# EAGLE design led-cube (EAGLE 6.5.0)
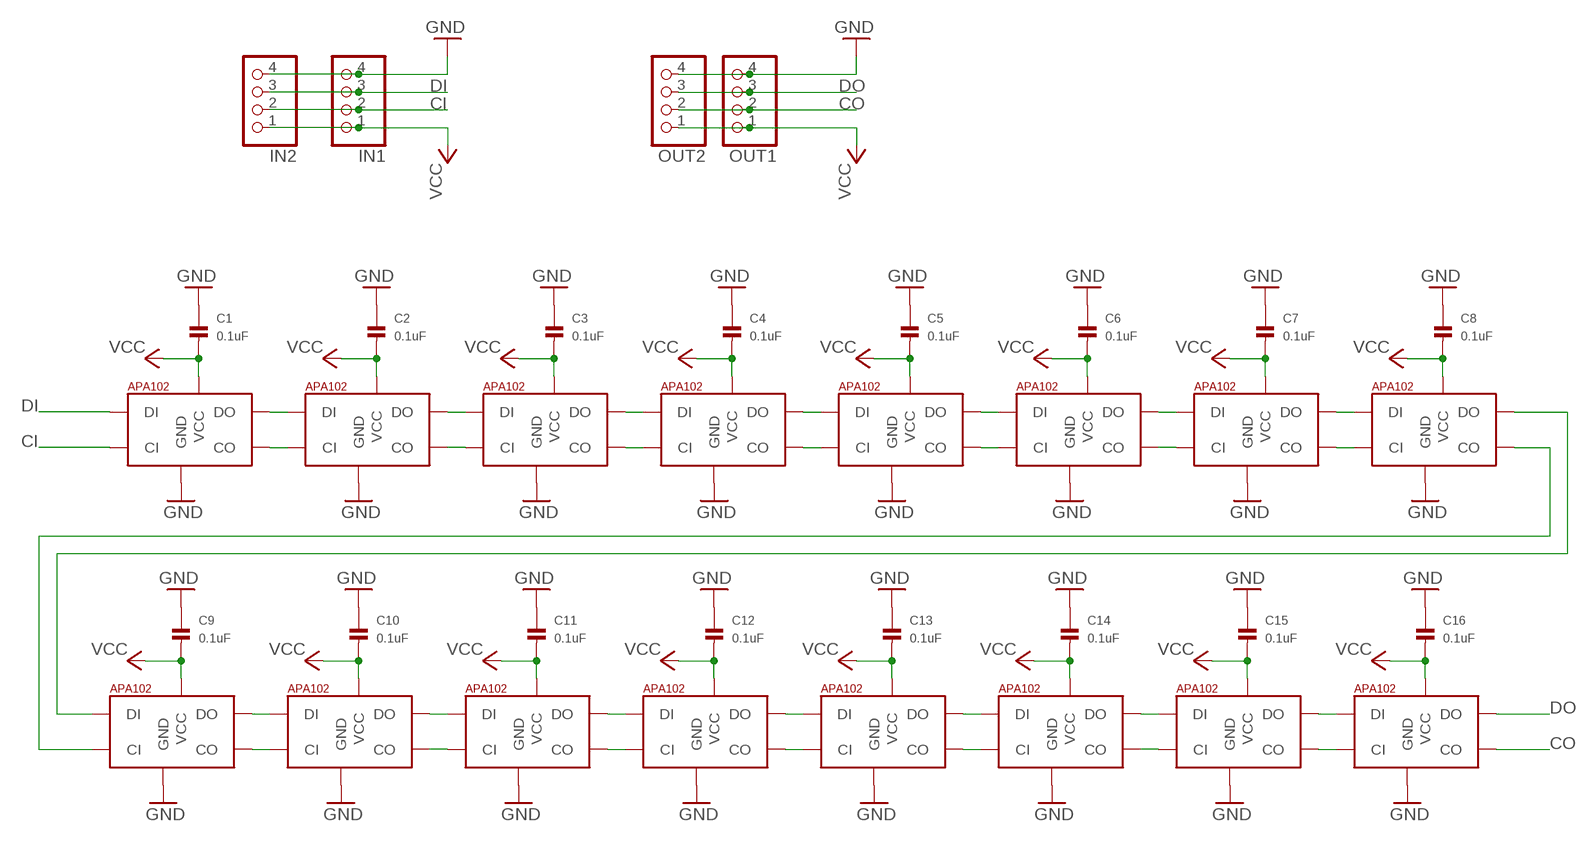
[diagram p0: schematic, sheet 1]

## Parts
C1  0.1uF  CAP_CERAMIC0603  [0603]
C2  0.1uF  CAP_CERAMIC0603  [0603]
C3  0.1uF  CAP_CERAMIC0603  [0603]
C4  0.1uF  CAP_CERAMIC0603  [0603]
C5  0.1uF  CAP_CERAMIC0603  [0603]
C6  0.1uF  CAP_CERAMIC0603  [0603]
C7  0.1uF  CAP_CERAMIC0603  [0603]
C8  0.1uF  CAP_CERAMIC0603  [0603]
C9  0.1uF  CAP_CERAMIC0603  [0603]
C10  0.1uF  CAP_CERAMIC0603  [0603]
C11  0.1uF  CAP_CERAMIC0603  [0603]
C12  0.1uF  CAP_CERAMIC0603  [0603]
C13  0.1uF  CAP_CERAMIC0603  [0603]
C14  0.1uF  CAP_CERAMIC0603  [0603]
C15  0.1uF  CAP_CERAMIC0603  [0603]
C16  0.1uF  CAP_CERAMIC0603  [0603]
IN1  PINHD-1X4  [1X04]
IN2  PINHD-1X4  [1X04]
OUT1  PINHD-1X4  [1X04]
OUT2  PINHD-1X4  [1X04]
U$1  APA1025050  [APA102_5050]
U$2  APA1025050  [APA102_5050]
U$3  APA1025050  [APA102_5050]
U$4  APA1025050  [APA102_5050]
U$5  APA1025050  [APA102_5050]
U$6  APA1025050  [APA102_5050]
U$7  APA1025050  [APA102_5050]
U$8  APA1025050  [APA102_5050]
U$9  APA1025050  [APA102_5050]
U$10  APA1025050  [APA102_5050]
U$11  APA1025050  [APA102_5050]
U$12  APA1025050  [APA102_5050]
U$13  APA1025050  [APA102_5050]
U$14  APA1025050  [APA102_5050]
U$15  APA1025050  [APA102_5050]
U$16  APA1025050  [APA102_5050]

## Nets
CI: IN1.2 IN2.2 U$1.5(CI)
CO: OUT1.2 OUT2.2 U$16.2(CO)
DI: IN1.3 IN2.3 U$1.4(DI)
DO: OUT1.3 OUT2.3 U$16.3(DO)
GND: C1.1 C2.1 C3.1 C4.1 C5.1 C6.1 C7.1 C8.1 C9.1 C10.1 C11.1 C12.1 C13.1 C14.1 C15.1 C16.1 IN1.4 IN2.4 OUT1.4 OUT2.4 U$1.6(GND) U$2.6(GND) U$3.6(GND) U$4.6(GND) U$5.6(GND) U$6.6(GND) U$7.6(GND) U$8.6(GND) U$9.6(GND) U$10.6(GND) U$11.6(GND) U$12.6(GND) U$13.6(GND) U$14.6(GND) U$15.6(GND) U$16.6(GND)
N$1: U$1.2(CO) U$2.5(CI)
N$2: U$1.3(DO) U$2.4(DI)
N$3: U$3.2(CO) U$4.5(CI)
N$4: U$3.3(DO) U$4.4(DI)
N$5: U$2.3(DO) U$3.4(DI)
N$6: U$2.2(CO) U$3.5(CI)
N$7: U$5.2(CO) U$6.5(CI)
N$8: U$5.3(DO) U$6.4(DI)
N$9: U$7.2(CO) U$8.5(CI)
N$10: U$7.3(DO) U$8.4(DI)
N$11: U$6.3(DO) U$7.4(DI)
N$12: U$6.2(CO) U$7.5(CI)
N$13: U$4.3(DO) U$5.4(DI)
N$14: U$4.2(CO) U$5.5(CI)
N$15: U$9.2(CO) U$10.5(CI)
N$16: U$9.3(DO) U$10.4(DI)
N$17: U$11.2(CO) U$12.5(CI)
N$18: U$11.3(DO) U$12.4(DI)
N$19: U$10.3(DO) U$11.4(DI)
N$20: U$10.2(CO) U$11.5(CI)
N$21: U$13.2(CO) U$14.5(CI)
N$22: U$13.3(DO) U$14.4(DI)
N$23: U$15.2(CO) U$16.5(CI)
N$24: U$15.3(DO) U$16.4(DI)
N$25: U$14.3(DO) U$15.4(DI)
N$26: U$14.2(CO) U$15.5(CI)
N$27: U$12.3(DO) U$13.4(DI)
N$28: U$12.2(CO) U$13.5(CI)
N$29: U$8.3(DO) U$9.4(DI)
N$30: U$8.2(CO) U$9.5(CI)
VCC: C1.2 C2.2 C3.2 C4.2 C5.2 C6.2 C7.2 C8.2 C9.2 C10.2 C11.2 C12.2 C13.2 C14.2 C15.2 C16.2 IN1.1 IN2.1 OUT1.1 OUT2.1 U$1.1(VCC) U$2.1(VCC) U$3.1(VCC) U$4.1(VCC) U$5.1(VCC) U$6.1(VCC) U$7.1(VCC) U$8.1(VCC) U$9.1(VCC) U$10.1(VCC) U$11.1(VCC) U$12.1(VCC) U$13.1(VCC) U$14.1(VCC) U$15.1(VCC) U$16.1(VCC)

## Library data of the parts
C1-C16 = microbuilder:CAP_CERAMIC: Ceramic Capacitors 0402 - 0402 Surface Mount Capacitors 16pF 50V 5% [Digikey: 445-4899-2-ND] 18pF 50V 5% [Digikey: 490-1281-2-ND] 22pF 50V 5% [Digikey: 490-1283-2-ND] 68pF 50V 5% [Digikey: 490-1289-2-ND] 0.1uF 10V 10% [Digikey: 490-1318-2-ND] 1.0uF 6.3V 10% [Digikey: 490-1320-2-ND] 0603 - 0603 Surface Mount Capacitors 16 pF 50V 5% [Digikey: 445-5051-2-ND] 22 pF 50V [Digikey: PCC220ACVTR-ND] 33 pF 50V 5% [Digikey: 490-1415-1-ND] 56pF 50V 5% [Digikey: 490-1421-1-ND] 220pF 50V 5% [Digikey: 445-1285-1-ND] 680 pF 50V 2200 pF 50V 5% C0G [Digikey: 445-1297-1-ND] 5600 pF 100V 5% X7R [Digikey: 478-3711-1-ND] 0.1 µF 25V 10% [Digikey: PCC2277TR-ND] 0.22 µF 16V 10% X7R [Digikey: 445-1318-1-ND] 1.0 µF 25V 10% [Digikey: 445-5146-2-ND] 0603 - RF Specific 3pF 250V +/-0.1pF RF [Digikey: 712-1347-1-ND] 18 pF 250V 5% [Digikey: 478-3505-1-ND or 712-1322-1-ND] 56 pF 250V 5% C0G RF [Digikey: 490-4867-1-ND] 68 pF 250V RF [Digikey: 490-4868-1-ND] 0805 - 0805 Surface Mount Capacitors 220 pF 250V 2% RF Ceramic Capacitor [Digikey: 712-1398-1-ND] 1000 pF 50V 2% NP0 Ceramic Capacitor [Digikey: 478-3760-1-ND] 0.1 µF 25V 10% Ceramic Capacitor [Digikey: PCC1828TR-ND] 1.0 µF 16V 10% Ceramic Capacitor[Digikey: 490-1691-2-ND] 10.0 µF 10V 10% Ceramic Capacitor[Digikey: 709-1228-1-ND] 10.0 uF 16V 10% Ceramic Capacitor [Digikey: 478-5165-2-ND] 47 uF 6.3V 20% Ceramic Capacitor [Digikey: 587-1779-1-ND or 399-5506-1-ND] 1206 - 1206 Surface Mount Capacitors 47uF 10V 20% Ceramic Capacitor [Digikey: 490-5528-1-ND or 399-5508-1-ND or 445-6010-1-ND] 100uF 6.3V -20%, +80% Y5V Ceramic Capacitor (Digikey: 490-4512-1-ND, Mouser: 81-GRM31CF50J107ZE1L)
IN1 IN2 OUT1 OUT2 = keves:PINHD-1X4: PIN HEADER
U$1-U$16 = jos-ph:APA102: APA102C 5050 RGB LED -- Adafruit DotStar Single LED Pixel Product Page: https://www.adafruit.com/products/2343 Datasheet: https://cdn-shop.adafruit.com/product-files/2343/APA102C.pdf

## Board
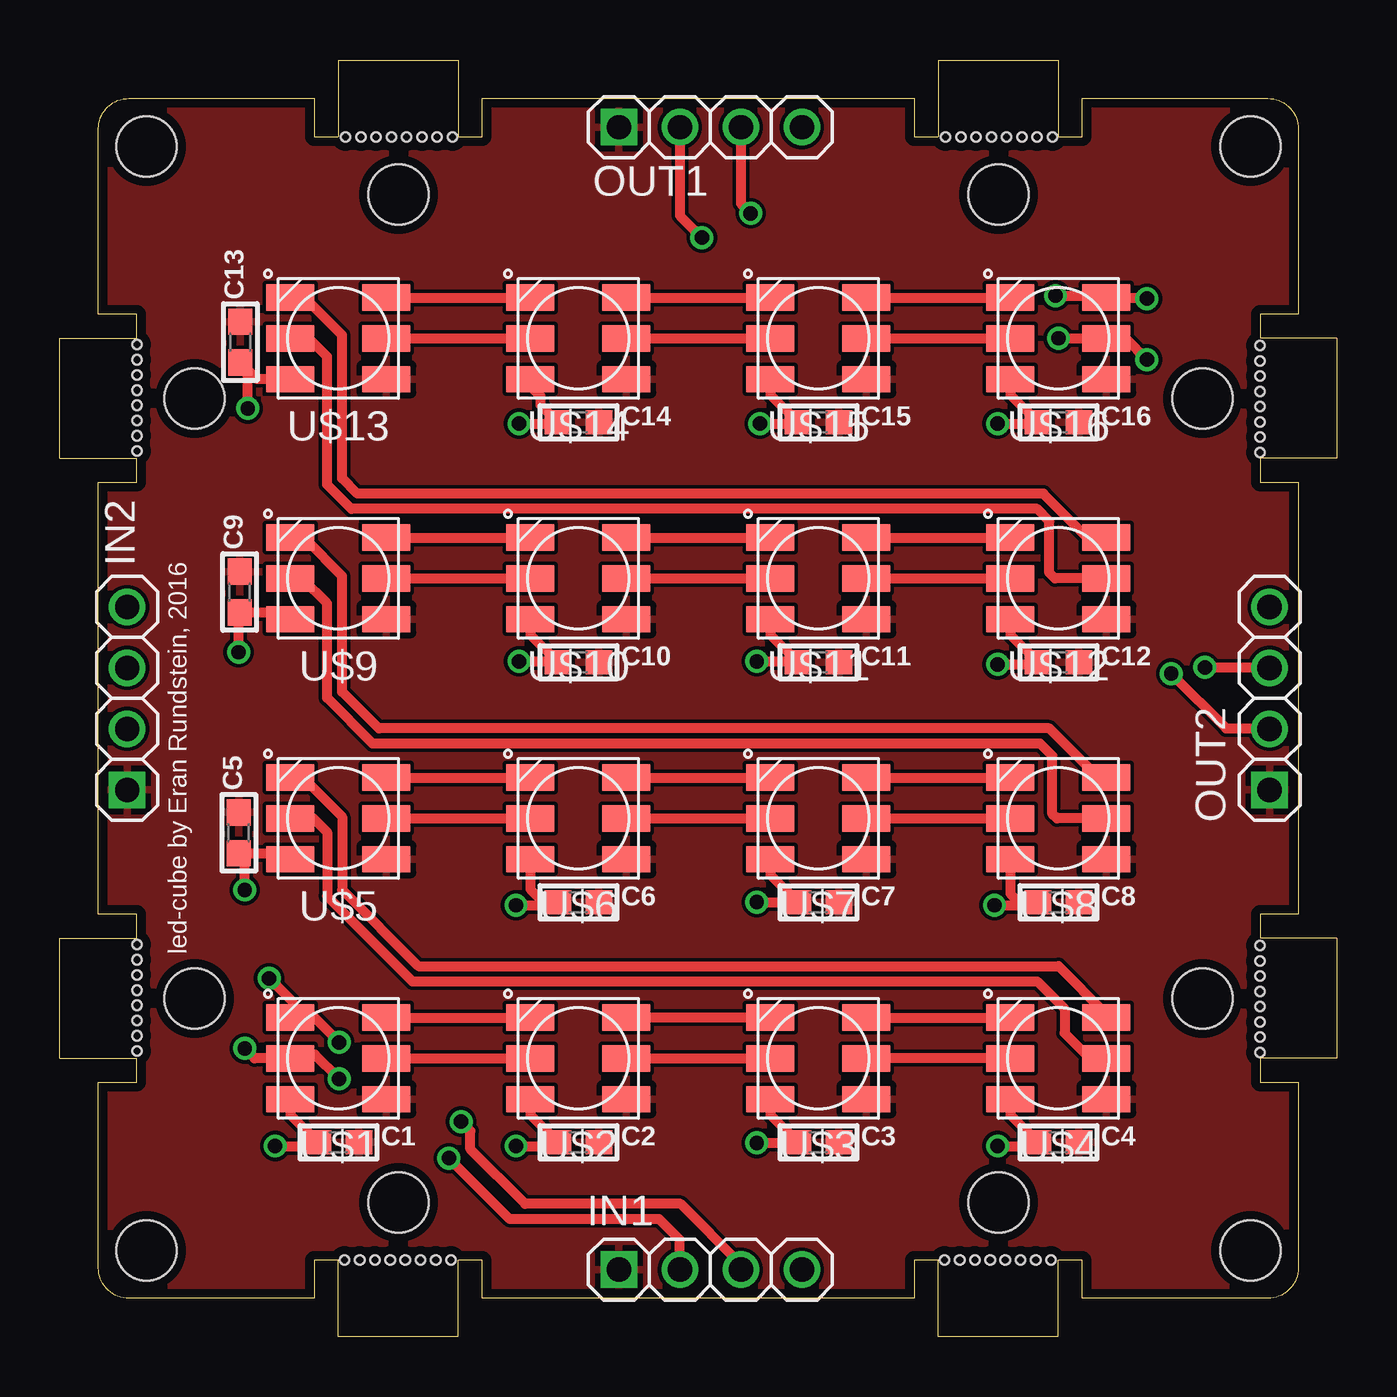
[diagram p1: board, top side]
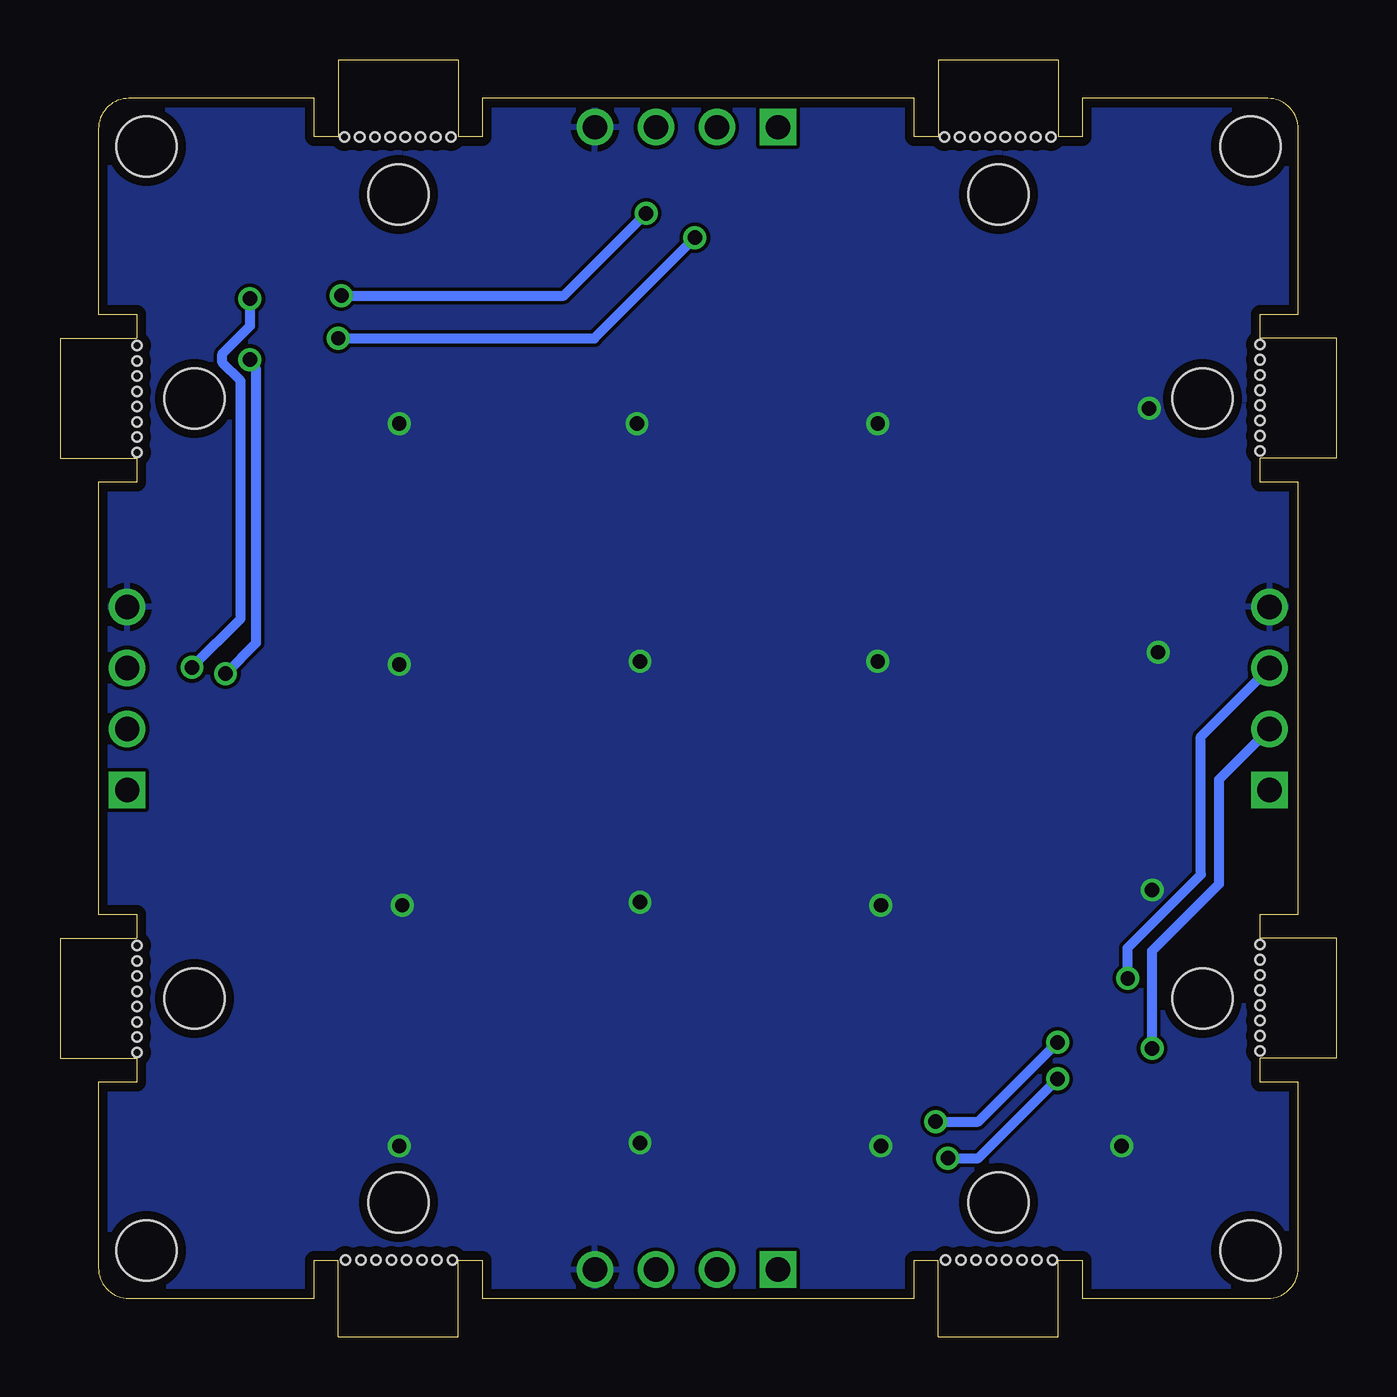
[diagram p2: board, bottom side, seen from below]

Size 53.2 x 53.2 mm. Coordinates in mm from the lower left corner, seen from the top.
Outline: 1.6,42.6 1.6,50.33 arc-90 2.87,51.6 10.6,51.6 10.6,50 11.6,50 11.6,53.2 16.6,53.2 16.6,50 17.6,50 17.6,51.6 35.6,51.6 35.6,50 36.6,50 36.6,53.2 41.6,53.2 41.6,50 42.6,50 42.6,51.6 50.33,51.6 arc-90 51.6,50.33 51.6,42.6 50,42.6 50,41.6 53.2,41.6 53.2,36.6 50,36.6 50,35.6 51.6,35.6 51.6,17.6 50,17.6 50,16.6 53.2,16.6 53.2,11.6 50,11.6 50,10.6 51.6,10.6 51.6,2.87 arc-90 50.33,1.6 42.6,1.6 42.6,3.2 41.6,3.2 41.6,0 36.6,0 36.6,3.2 35.6,3.2 35.6,1.6 17.6,1.6 17.6,3.2 16.6,3.2 16.6,0 11.6,0 11.6,3.2 10.6,3.2 10.6,1.6 2.87,1.6 arc-90 1.6,2.87 1.6,10.6 3.2,10.6 3.2,11.6 0,11.6 0,16.6 3.2,16.6 3.2,17.6 1.6,17.6 1.6,35.6 3.2,35.6 3.2,36.6 0,36.6 0,41.6 3.2,41.6 3.2,42.6 1.6,42.6
Copper layers (1*16): Top 0.0356mm / dielectric 1.5011mm / Bottom 0.0356mm
Design rules "oshpark *": minimum track width 6mil, minimum drill 13mil, track to track 6mil, track to pad 6mil, pad to pad 6mil, via to via 6mil, smd to smd 6mil, copper to edge 15mil, drill to drill 6mil, minimum pad ring 7mil, minimum via ring 7mil, stop-mask expansion 3mil, vias tented up to drill 0mil, thermal gap 10mil
Holes 0.38 mm at 11.9,50 12.54,50 13.17,50 13.81,50 14.44,50 15.08,50 15.71,50 16.35,50 36.9,50 37.54,50 38.17,50 38.81,50 39.44,50 40.08,50 40.71,50 41.35,50 41.3,3.2 40.66,3.2 40.03,3.2 39.39,3.2 38.76,3.2 38.12,3.2 37.49,3.2 36.85,3.2 16.3,3.2 15.66,3.2 15.03,3.2 14.39,3.2 13.76,3.2 13.12,3.2 12.49,3.2 11.85,3.2 50,41.3 50,40.66 50,40.03 50,39.39 50,38.76 50,38.12 50,37.49 50,36.85 50,16.3 50,15.66 50,15.03 50,14.39 50,13.76 50,13.12 50,12.49 50,11.85 3.2,11.9 3.2,12.54 3.2,13.17 3.2,13.81 3.2,14.44 3.2,15.08 3.2,15.71 3.2,16.35 3.2,36.9 3.2,37.54 3.2,38.17 3.2,38.81 3.2,39.44 3.2,40.08 3.2,40.71 3.2,41.35
Holes 2.5 mm at 3.6,3.6 3.6,49.6 49.6,49.6 49.6,3.6 14.1,47.6 39.1,47.6 14.1,5.6 39.1,5.6 5.6,14.1 5.6,39.1 47.6,39.1 47.6,14.1

### Footprints (pad centres in the part's own frame; a part is rotated, then mirrored left to right if it is on the bottom)
0603 = smd 1.1 x 1: 1 -0.85,0; 2 0.85,0
1X04 = drill 1.016 square: 1 -3.81,0 | drill 1.016: 2 -1.27,0; 3 1.27,0; 4 3.81,0
APA102_5050 = smd 2 x 1.1: 1 2,-1.7; 2 2,0; 3 2,1.7; 4 -2,1.7; 5 -2,0; 6 -2,-1.7

### Placement (x,y rotation side)
C1  11.6,8.1 0 top
C2  21.6,8.1 0 top
C3  31.6,8.1 0 top
C4  41.6,8.1 0 top
C5  7.45,21 90 top
C6  21.6,18.1 0 top
C7  31.6,18.1 0 top
C8  41.6,18.1 0 top
C9  7.48,31.03 90 top
C10  21.6,28.1 0 top
C11  31.6,28.1 0 top
C12  41.6,28.1 0 top
C13  7.52,41.45 90 top
C14  21.6,38.1 0 top
C15  31.6,38.1 0 top
C16  41.6,38.1 0 top
IN1  27.1,2.8 0 top
IN2  2.8,26.6 90 top
OUT1  27.1,50.4 0 top
OUT2  50.4,26.6 90 top
U$1  11.6,11.6 0 top
U$2  21.6,11.6 0 top
U$3  31.6,11.6 0 top
U$4  41.6,11.6 0 top
U$5  11.6,21.6 0 top
U$6  21.6,21.6 0 top
U$7  31.6,21.6 0 top
U$8  41.6,21.6 0 top
U$9  11.6,31.6 0 top
U$10  21.6,31.6 0 top
U$11  31.6,31.6 0 top
U$12  41.6,31.6 0 top
U$13  11.6,41.6 0 top
U$14  21.6,41.6 0 top
U$15  31.6,41.6 0 top
U$16  41.6,41.6 0 top

### Tracks (layer width: path | path; a pad name or v marks a point on that pad's centre or on a via)
CI  (via drill 0.6)
  Top 0.406: IN1.2 25.83,4.04 24.97,4.9 18.75,4.9 v16.21,7.44 | v11.63,10.74 10.62,11.76 9.76,11.76 U$1.5 8.11,11.6 v7.7,12.01
  Bottom 0.406: v16.21,7.44 14.94,7.44 v11.63,10.74 | v7.7,12.01 7.7,16.08 4.9,18.87 4.9,23.23 IN2.2
CO  (via drill 0.6)
  Top 0.406: OUT1.2 25.83,46.71 v26.75,45.8 | v41.61,41.61 U$16.2 44.4,41.6 v45.29,40.72 | v46.3,27.64 48.59,25.35 50.38,25.35 OUT2.2
  Bottom 0.406: v41.61,41.61 30.94,41.61 v26.75,45.8 | v46.3,27.64 45.03,28.91 45.03,40.34 45.29,40.59 v45.29,40.72
DI  (via drill 0.6)
  Top 0.406: IN1.3 28.37,3.02 25.86,5.54 19.38,5.54 17.09,7.82 17.09,8.59 v16.71,8.97 | v11.63,12.27 10.49,13.41 9.71,13.41 | 9.71,13.41 U$1.4 | 9.71,13.41 9.71,13.94 v8.71,14.94
  Bottom 0.406: v16.71,8.97 14.94,8.97 v11.63,12.27 | v8.71,14.94 8.71,16.21 5.66,19.25 5.66,25.01 IN2.3
DO  (via drill 0.6)
  Top 0.406: OUT1.3 28.37,47.22 v28.78,46.81 | v41.48,43.38 43.52,43.38 U$16.3 45.24,43.3 v45.29,43.26 | v47.7,27.89 50.38,27.89 OUT2.3
  Bottom 0.406: v41.48,43.38 32.21,43.38 v28.78,46.81 | v45.29,43.26 45.29,42.11 46.43,40.97 46.43,40.59 45.67,39.83 45.67,29.92 v47.7,27.89
GND  (via drill 0.6)
  Top 0.406: U$1.6 9.6,9.25 C1.1 10.6,7.95 v8.97,7.95 | v19,7.95 20.6,7.95 C2.1 19.6,9.25 U$2.6 | v29.03,8.08 30.73,8.08 C3.1 29.6,9.25 U$3.6 | v39.07,7.95 40.6,7.95 C4.1 39.6,9.25 U$4.6 | v38.94,17.98 40.08,17.98 | 40.08,17.98 40.63,17.98 C8.1 | U$8.6 39.6,18.46 40.08,17.98 | v29.03,18.11 C7.1 29.6,19.25 U$7.6 | v19,17.98 20.27,17.98 | 20.27,17.98 20.63,17.98 C6.1 | U$6.6 19.6,18.65 20.27,17.98 | v19.13,28.14 20.71,28.14 C10.1 19.6,29.25 U$10.6 | v29.03,28.14 30.71,28.14 C11.1 29.6,29.25 U$11.6 | v39.07,28.02 40.67,28.02 C12.1 39.6,29.25 U$12.6 | v39.07,38.05 40.7,38.05 C16.1 39.6,39.25 U$16.6 | v29.16,38.05 30.7,38.05 C15.1 29.6,39.25 U$15.6 | v19.13,38.05 20.7,38.05 C14.1 20.02,38.84 20.02,39.19 19.6,39.61 U$14.6 | v7.44,28.52 7.44,30.14 C9.1 9.32,30.18 U$9.6 | v7.7,18.62 7.7,19.9 C5.1 9.35,20.15 U$5.6 | v7.82,38.68 7.82,40.29 C13.1 8.21,39.9 U$13.6
  pour Bottom: 0.1,55.1 54.6,55.1 54.6,-0.9 0.1,-0.9 0.1,54.6
N$1
  Top 0.406: U$1.2 U$2.5
N$2
  Top 0.406: U$1.3 U$2.4
N$3
  Top 0.406: U$4.5 U$3.2
N$4
  Top 0.406: U$3.3 U$4.4
N$5
  Top 0.406: U$3.4 U$2.3
N$6
  Top 0.406: U$2.2 U$3.5
N$7
  Top 0.406: U$5.2 U$6.5
N$8
  Top 0.406: U$5.3 U$6.4
N$9
  Top 0.406: U$7.2 U$8.5
N$10
  Top 0.406: U$7.3 U$8.4
N$11
  Top 0.406: U$6.3 U$7.4
N$12
  Top 0.406: U$6.2 U$7.5
N$13
  Top 0.406: U$4.3 43.6,13.45 41.61,15.44 14.94,15.44 11.76,18.62 11.76,21.67 10.24,23.19 9.49,23.19 U$5.4 9.46,23.44
N$14
  Top 0.406: U$5.5 10.56,21.6 11.12,21.03 11.12,18.36 14.68,14.81 40.72,14.81 41.86,13.66 41.86,12.65 42.88,11.63 43.57,11.63 U$4.2
N$15
  Top 0.406: U$9.2 U$10.5
N$16
  Top 0.406: U$9.3 U$10.4
N$17
  Top 0.406: U$11.2 U$12.5
N$18
  Top 0.406: U$11.3 U$12.4
N$19
  Top 0.406: U$10.3 U$11.4
N$20
  Top 0.406: U$10.2 U$11.5 | U$11.5 30.02,31.6 30.18,31.45 29.76,31.45 U$11.5
N$21
  Top 0.406: U$13.2 U$14.5
N$22
  Top 0.406: U$13.3 U$14.4
N$23
  Top 0.406: U$15.2 U$16.5
N$24
  Top 0.406: U$15.3 U$16.4
N$25
  Top 0.406: U$14.3 U$15.4
N$26
  Top 0.406: U$14.2 U$15.5
N$27
  Top 0.406: U$12.3 42.8,33.3 40.97,35.13 12.39,35.13 11.76,35.76 11.76,41.73 10.24,43.26 9.64,43.26 U$13.4
N$28
  Top 0.406: U$12.2 41.45,31.6 41.22,31.83 41.22,33.98 40.72,34.49 12.14,34.49 11.12,35.51 11.12,40.84 10.36,41.61 U$13.5
N$29
  Top 0.406: U$8.3 43.27,23.3 41.22,25.35 13.28,25.35 11.76,26.87 11.76,31.7 10.24,33.22 9.68,33.22 U$9.4
N$30
  Top 0.406: U$8.2 41.54,21.6 41.35,21.79 41.35,24.21 40.84,24.71 13.03,24.71 11.12,26.62 11.12,30.56 10.11,31.57 9.63,31.57 U$9.5
VCC
  pour Top: 0.1,53.6 54.1,53.6 54.1,-0.9 0.1,-0.9

### Text on the board
tPlace: led-cube by Eran Rundstein, 2016